# Altium schematic sheet SmartIMU_TestBoard_Sch.SchDoc
size A4; PageSetup: Record=PageOptions|CenterHorizontal=True|CenterVertical=True|PrintScale=1.00|XCorrection=1.00|YCorrection=1.00|PrintKind=0|BorderSize=5000000|LeftOffset=0|BottomOffset=0|Orientation=2|PaperLength=1000|PaperWidth=1000|Scale=100|PaperSource=7|PrintQuality=-4|MediaType=1|DitherType=10|PaperKind=A4|PrintScaleMode=1
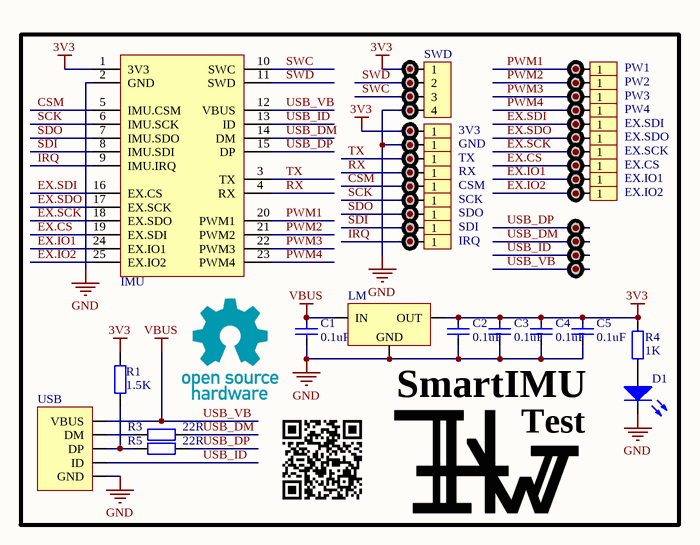
[diagram p0: SmartIMU_TestBoard_Sch.SchDoc]

## Parts
3V3  HDR1X1_180_2.54  [HDR1X1_180_2.54]  (value not drawn)
C1  value 0.1uF  [CAP_0603]  (hidden comment: Cap_0603)
C2  value 0.1uF  [CAP_0603]  (hidden comment: Cap_0603)
C3  value 0.1uF  [CAP_0603]  (hidden comment: Cap_0603)
C4  value 0.1uF  [CAP_0603]  (hidden comment: Cap_0603)
C5  value 0.1uF  [CAP_0603]  (hidden comment: Cap_0603)
CSM  HDR1X1_180_2.54  [HDR1X1_180_2.54]  (value not drawn)
D1  LED_0603_BLUE  [LED_0603_BLUE]  (value not drawn)
EX.CS  HDR1X1_180_2.54  [HDR1X1_180_2.54]  (value not drawn)
EX.IO1  HDR1X1_180_2.54  [HDR1X1_180_2.54]  (value not drawn)
EX.IO2  HDR1X1_180_2.54  [HDR1X1_180_2.54]  (value not drawn)
EX.SCK  HDR1X1_180_2.54  [HDR1X1_180_2.54]  (value not drawn)
EX.SDI  HDR1X1_180_2.54  [HDR1X1_180_2.54]  (value not drawn)
EX.SDO  HDR1X1_180_2.54  [HDR1X1_180_2.54]  (value not drawn)
GND  HDR1X1_180_2.54  [HDR1X1_180_2.54]  (value not drawn)
HW  HW  [Logo_HW_v2.0]  (value not drawn)
IMU  SmartIMU_Full  [SMART_IMU_FULL]  (value not drawn)
IRQ  HDR1X1_180_2.54  [HDR1X1_180_2.54]  (value not drawn)
LM  LM1117  [SOT223]  (value not drawn)
ORCODE  SmartIMU_ORCODE  (value not drawn)
OSHW  OSHW  (value not drawn)
PW1  HDR1X1_180_2.54  [HDR1X1_180_2.54]  (value not drawn)
PW2  HDR1X1_180_2.54  [HDR1X1_180_2.54]  (value not drawn)
PW3  HDR1X1_180_2.54  [HDR1X1_180_2.54]  (value not drawn)
PW4  HDR1X1_180_2.54  [HDR1X1_180_2.54]  (value not drawn)
R1  value 1.5K  [RES_0603]  (hidden comment: Res_0603)
R3  value 22R  [RES_0603]  (hidden comment: Res_0603)
R4  value 1K  [RES_0603]  (hidden comment: Res_0603)
R5  value 22R  [RES_0603]  (hidden comment: Res_0603)
RX  HDR1X1_180_2.54  [HDR1X1_180_2.54]  (value not drawn)
SCK  HDR1X1_180_2.54  [HDR1X1_180_2.54]  (value not drawn)
SDI  HDR1X1_180_2.54  [HDR1X1_180_2.54]  (value not drawn)
SDO  HDR1X1_180_2.54  [HDR1X1_180_2.54]  (value not drawn)
SWD  HDR1X4_90F_2.54  [HDR1X4_90F_2.54]  (value not drawn)
TP1  TestPoint_HalfH  [TestPoint_0.6mm_HelfH]  (value not drawn)
TP2  TestPoint_HalfH  [TestPoint_0.6mm_HelfH]  (value not drawn)
TP3  TestPoint_HalfH  [TestPoint_0.6mm_HelfH]  (value not drawn)
TP4  TestPoint_HalfH  [TestPoint_0.6mm_HelfH]  (value not drawn)
TP5  TestPoint_HalfH  [TestPoint_0.6mm_HelfH]  (value not drawn)
TP6  TestPoint_HalfH  [TestPoint_0.6mm_HelfH]  (value not drawn)
TP7  TestPoint_HalfH  [TestPoint_0.6mm_HelfH]  (value not drawn)
TP8  TestPoint_HalfH  [TestPoint_0.6mm_HelfH]  (value not drawn)
TP9  TestPoint_HalfH  [TestPoint_0.6mm_HelfH]  (value not drawn)
TP10  TestPoint_HalfH  [TestPoint_0.6mm_HelfH]  (value not drawn)
TP11  TestPoint_HalfH  [TestPoint_0.6mm_HelfH]  (value not drawn)
TP12  TestPoint_HalfH  [TestPoint_0.6mm_HelfH]  (value not drawn)
TP13  TestPoint_HalfH  [TestPoint_0.6mm_HelfH]  (value not drawn)
TP14  TestPoint_HalfH  [TestPoint_0.6mm_HelfH]  (value not drawn)
TP15  TestPoint_HalfH  [TestPoint_0.6mm_HelfH]  (value not drawn)
TP16  TestPoint_HalfH  [TestPoint_0.6mm_HelfH]  (value not drawn)
TP17  TestPoint_HalfH  [TestPoint_0.6mm_HelfH]  (value not drawn)
TP18  TestPoint_HalfH  [TestPoint_0.6mm_HelfH]  (value not drawn)
TP19  TestPoint_HalfH  [TestPoint_0.6mm_HelfH]  (value not drawn)
TP20  TestPoint_HalfH  [TestPoint_0.6mm_HelfH]  (value not drawn)
TP21  TestPoint_HalfH  [TestPoint_0.6mm_HelfH]  (value not drawn)
TP22  TestPoint_HalfH  [TestPoint_0.6mm_HelfH]  (value not drawn)
TP23  TestPoint_HalfH  [TestPoint_0.6mm_HelfH]  (value not drawn)
TP24  TestPoint_HalfH  [TestPoint_0.6mm_HelfH]  (value not drawn)
TP25  TestPoint_HalfH  [TestPoint_0.6mm_HelfH]  (value not drawn)
TP26  TestPoint_HalfH  [TestPoint_0.6mm_HelfH]  (value not drawn)
TP27  TestPoint_HalfH  [TestPoint_0.6mm_HelfH]  (value not drawn)
TX  HDR1X1_180_2.54  [HDR1X1_180_2.54]  (value not drawn)
USB  USB_Micro  [USB_Micro-AB]  (value not drawn)

## Blocks framed on the sheet
Test: 3V3 C1-C5 CSM D1 EX.CS EX.IO1 EX.IO2 EX.SCK EX.SDI EX.SDO GND IMU IRQ LM ORCODE OSHW PW1-PW4 R1 R3-R5 RX SCK SDI SDO SWD TP1-TP27 TX USB
SmartIMU: HW

## Nets
3V3: 3V3.1 C2.2 C3.2 C4.2 C5.2 IMU.1(3V3) LM.2(OUT) R1.2 R4.2 SWD.1 TP1.1(TP) TP5.1(TP)
GND: C1.2 C2.1 C3.1 C4.1 C5.1 D1.2(K) GND.1 IMU.2(GND) LM.1(GND) SWD.4 TP4.1(TP) TP6.1(TP) USB.5(GND)
USB_VB: C1.1 IMU.12(VBUS) LM.3(IN) TP27.1(TP) USB.1(VBUS)  [also labelled VBUS]
CSM: CSM.1 IMU.5(IMU.CSM) TP7.1(TP)
EX.CS: EX.CS.1 IMU.19(EX.SDI) TP21.1(TP)
EX.IO1: EX.IO1.1 IMU.24(EX.IO1) TP22.1(TP)
EX.IO2: EX.IO2.1 IMU.25(EX.IO2) TP23.1(TP)
EX.SCK: EX.SCK.1 IMU.18(EX.SDO) TP20.1(TP)
EX.SDI: EX.SDI.1 IMU.16(EX.CS) TP18.1(TP)
EX.SDO: EX.SDO.1 IMU.17(EX.SCK) TP19.1(TP)
IRQ: IMU.9(IMU.IRQ) IRQ.1 TP11.1(TP)
PWM1: IMU.20(PWM1) PW1.1 TP14.1(TP)
PWM2: IMU.21(PWM2) PW2.1 TP15.1(TP)
PWM3: IMU.22(PWM3) PW3.1 TP16.1(TP)
PWM4: IMU.23(PWM4) PW4.1 TP17.1(TP)
RX: IMU.4(RX) RX.1 TP12.1(TP)
SCK: IMU.6(IMU.SCK) SCK.1 TP8.1(TP)
SDI: IMU.8(IMU.SDI) SDI.1 TP10.1(TP)
SDO: IMU.7(IMU.SDO) SDO.1 TP9.1(TP)
SWC: IMU.10(SWC) SWD.3 TP3.1(TP)
SWD: IMU.11(SWD) SWD.2 TP2.1(TP)
TX: IMU.3(TX) TP13.1(TP) TX.1
USB_DM: IMU.14(DM) R3.2 TP25.1(TP)
USB_DP: IMU.15(DP) R5.2 TP24.1(TP)
USB_ID: IMU.13(ID) TP26.1(TP) USB.4(ID)
NetD1_1: D1.1(A) R4.1
NetR1_1: R1.1 R5.1 USB.3(DP)
NetR3_1: R3.1 USB.2(DM)

## Library data of the parts
3V3 CSM EX.CS EX.IO1 EX.IO2 EX.SCK EX.SDI EX.SDO GND IRQ PW1-PW4 RX SCK SDI SDO TX = HDR1X1_180_2.54: Header
C1-C5 = Cap_0603: Capacitor
D1 = LED_0603_BLUE: LED
HW = HW: Logo
IMU = SmartIMU_Full: Module
LM = LM1117: Power
ORCODE = SmartIMU_ORCODE: Logo
OSHW = OSHW: Logo
R1 R3-R5 = Res_0603: Resistor
SWD = HDR1X4_90F_2.54: Header
TP1-TP27 = TestPoint_HalfH: TestPoint
USB = USB_Micro: USB